# EAGLE design BotMotShielArdu (EAGLE 6.4)
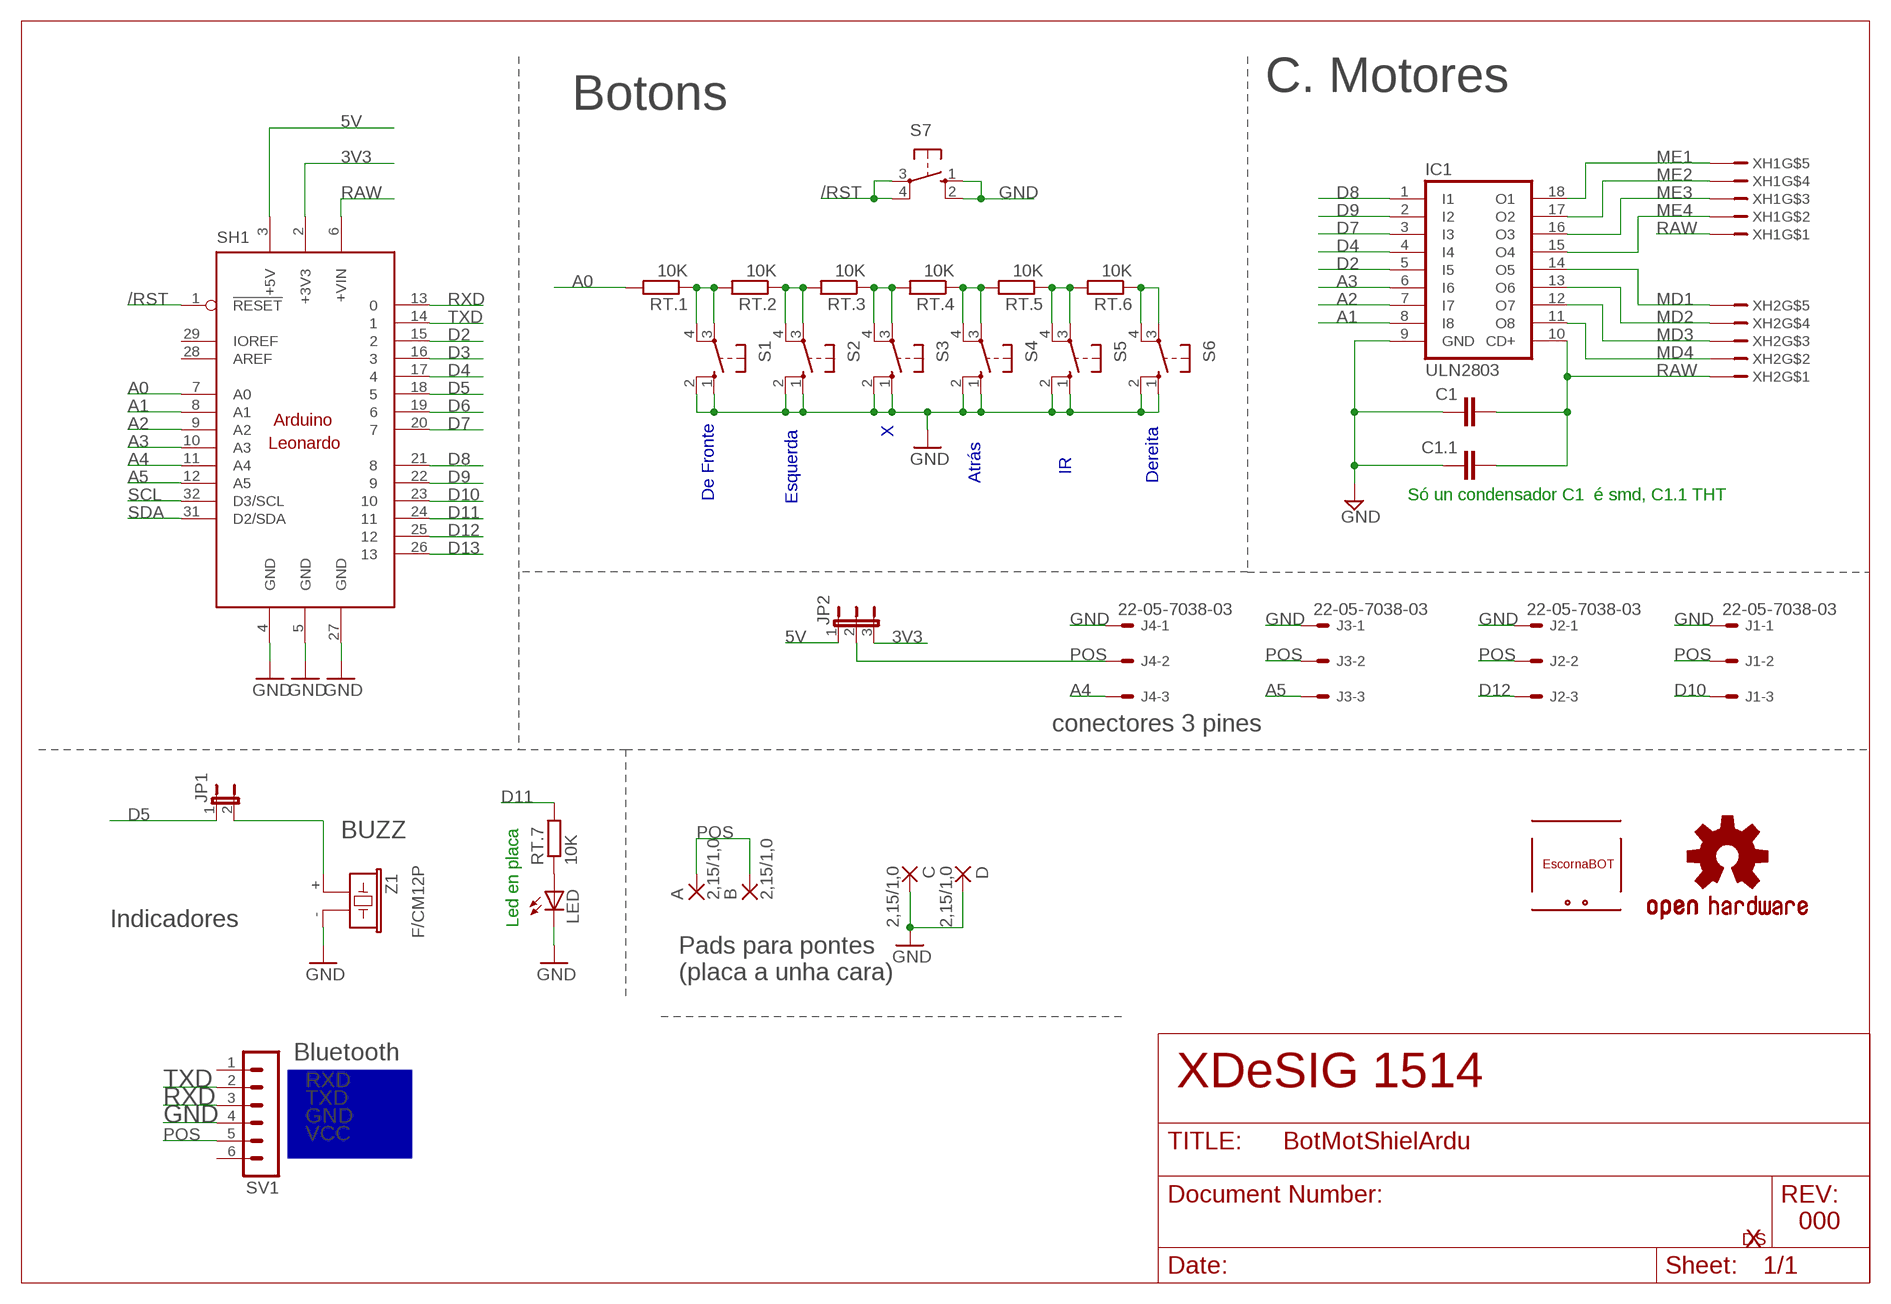
[diagram p0: schematic, sheet 1]

## Parts
A  2,15/1,0  WIREPAD2,15/1,0  [2,15/1,0]
B  2,15/1,0  WIREPAD2,15/1,0  [2,15/1,0]
C  2,15/1,0  WIREPAD2,15/1,0  [2,15/1,0]
C1  C-EUC1206  [C1206]
C1.1  C-EU025-024X044  [C025-024X044]
D  2,15/1,0  WIREPAD2,15/1,0  [2,15/1,0]
IC1  ULN2803  ULN2803A  [DIL18]
J1  22-05-7038-03  [7395-03]
J2  22-05-7038-03  [7395-03]
J3  22-05-7038-03  [7395-03]
J4  22-05-7038-03  [7395-03]
JP1  JP1E  [JP1]
JP2  JP2E  [JP2]
LED  LED5MM  [LED5MM]
LOGO4  OSHW-LOGOS  [OSHW-LOGO-S]
RT.1  10K  R-EU_0204/7  [0204/7]
RT.2  10K  R-EU_0204/7  [0204/7]
RT.3  10K  R-EU_0204/7  [0204/7]
RT.4  10K  R-EU_0204/7  [0204/7]
RT.5  10K  R-EU_0204/7  [0204/7]
RT.6  10K  R-EU_0204/7  [0204/7]
RT.7  10K  R-EU_0204/7  [0204/7]
S1  B3F-40XX  40-XX  [B3F40XX_NH]
S2  B3F-40XX  40-XX  [B3F40XX_NH]
S3  B3F-40XX  40-XX  [B3F40XX_NH]
S4  B3F-40XX  40-XX  [B3F40XX_NH]
S5  B3F-40XX  40-XX  [B3F40XX_NH]
S6  B3F-40XX  40-XX  [B3F40XX_NH]
S7  10-XX  [B3F-10XX]
SH1  ARDUINO_LEONARDO  [LEONARDO]
SV1  MA06-1  [MA06-1]
U$1  ESCORNABOT  [ESCORNA_PEQUE]
U$3  XDESIG1  [XDESIG_CU]
XH1  B5B-XH-A  [B5B-XH-A]
XH2  B5B-XH-A  [B5B-XH-A]
Z1  F/CM12P  [F/CM12P]

## Nets
3V3: JP2.3 SH1.2(+3V3)
5V: JP2.1 SH1.3(+5V)
/RST: S7.3(P) S7.4(P1) SH1.1(!RESET)
A0: RT.1.2 SH1.7(A0)
A1: IC1.8(I8) SH1.8(A1)
A2: IC1.7(I7) SH1.9(A2)
A3: IC1.6(I6) SH1.10(A3)
A4: J4.3 SH1.11(A4)
A5: J3.3 SH1.12(A5)
D2: IC1.5(I5) SH1.15
D3: SH1.16
D4: IC1.4(I4) SH1.17
D5: JP1.1 SH1.18
D6: SH1.19
D7: IC1.3(I3) SH1.20
D8: IC1.1(I1) SH1.21
D9: IC1.2(I2) SH1.22
D10: J1.3 SH1.23
D11: RT.7.2 SH1.24
D12: J2.3 SH1.25
D13: SH1.26
GND: C1.1 C1.1.1 C.1(P) D.1(P) IC1.9(GND) J1.1 J2.1 J3.1 J4.1 LED.K(C) S1.1(S) S1.2(S1) S2.1(S) S2.2(S1) S3.1(S) S3.2(S1) S4.1(S) S4.2(S1) S5.1(S) S5.2(S1) S6.1(S) S6.2(S1) S7.1(S) S7.2(S1) SH1.4(GND) SH1.5(GND) SH1.27(GND) SV1.4 Z1.-
MD1: IC1.14(O5) XH2.P$5
MD2: IC1.13(O6) XH2.P$4
MD3: IC1.12(O7) XH2.P$3
MD4: IC1.11(O8) XH2.P$2
ME1: IC1.18(O1) XH1.P$5
ME2: IC1.17(O2) XH1.P$4
ME3: IC1.16(O3) XH1.P$3
ME4: IC1.15(O4) XH1.P$2
N$9: LED.A RT.7.1
N$28: RT.6.1 S6.3(P) S6.4(P1)
N$29: RT.1.1 RT.2.2 S1.3(P) S1.4(P1)
N$30: JP1.2 Z1.+
N$31: RT.5.1 RT.6.2 S5.3(P) S5.4(P1)
N$32: RT.4.1 RT.5.2 S4.3(P) S4.4(P1)
N$33: RT.3.1 RT.4.2 S3.3(P) S3.4(P1)
N$34: RT.2.1 RT.3.2 S2.3(P) S2.4(P1)
POS: A.1(P) B.1(P) J1.2 J2.2 J3.2 J4.2 JP2.2 SV1.5
RAW: C1.1.2 C1.2 IC1.10(CD+) SH1.6(+VIN) XH1.P$1 XH2.P$1
RXD: SH1.13 SV1.3
SCL: SH1.32(D3/SCL)
SDA: SH1.31(D2/SDA)
TXD: SH1.14 SV1.2
Unconnected: SH1.28(AREF) SH1.29(IOREF) SV1.1 SV1.6

## Notes on the sheet
- C. Motores
- Botons
- Esquerda
- X
- IR
- Atrás | Dereita
- De Fronte | Só un condensador C1  é smd, C1.1 THT
- conectores 3 pines
- BUZZ
- Indicadores | Led en placa
- Pads para pontes
  (placa a unha cara)
- Bluetooth
- RXD | XDeSIG | 1514
- TXD
- GND
- VCC
- 000

## Library data of the parts
A B C D = wirepad:WIREPAD: Wire PAD connect wire on PCB
C1 C1.1 = rcl:C-EU: CAPACITOR, European symbol
IC1 = uln-udn:ULN2803A: DRIVER ARRAY
J1-J4 = con-molex:22-?-03: CONNECTOR wire to board 2.54 mm (.1 inch) pitch header; OC_FARNELL: unknown; OC_NEWARK: unknown
JP1 = jumper:JP1E: JUMPER
JP2 = jumper:JP2E: JUMPER
LED = adafruit:LED: LED OSRAM: - CHIPLED LG R971, LG N971, LY N971, LG Q971, LY Q971, LO R971, LY R971 LH N974, LH R974 LS Q976, LO Q976, LY Q976 LO Q996 - Hyper CHIPLED LW Q18S LB Q993, LB Q99A, LB R99A - SideLED LS A670, LO A670, LY A670, LG A670, LP A670 LB A673, LV A673, LT A673, LW A673 LH A674 LY A675 LS A676, LA A676, LO A676, LY A676, LW A676 LS A679, LY A679, LG A679 - Hyper Micro SIDELED® LS Y876, LA Y876, LO Y876, LY Y876 LT Y87S - SmartLED LW L88C, LW L88S LB L89C, LB L89S, LG L890 LS L89K, LO L89K, LY L89K LS L896, LA L896, LO L896, LY L896 - TOPLED LS T670, LO T670, LY T670, LG T670, LP T670 LSG T670, LSP T670, LSY T670, LOP T670, LYG T670 LG T671, LOG T671, LSG T671 LB T673, LV T673, LT T673, LW T673 LH T674 LS T676, LA T676, LO T676, LY T676, LB T676, LH T676, LSB T676, LW T676 LB T67C, LV T67C, LT T67C, LS T67K, LO T67K, LY T67K, LW E67C LS E67B, LA E67B, LO E67B, LY E67B, LB E67C, LV E67C, LT E67C LW T67C LS T679, LY T679, LG T679 LS T770, LO T770, LY T770, LG T770, LP T770 LB T773, LV T773, LT T773, LW T773 LH T774 LS E675, LA E675, LY E675, LS T675 LS T776, LA T776, LO T776, LY T776, LB T776 LHGB T686 LT T68C, LB T68C - Hyper Mini TOPLED® LB M676 - Mini TOPLED Santana® LG M470 LS M47K, LO M47K, LY M47K Source: http://www.osram.convergy.de/
LOGO4 = SparkFun-Aesthetics:OSHW-LOGO: Open Source Hardware Logo This logo indicates the piece of hardware it is found on incorporates a OSHW license and/or adheres to the definition of open source hardware found here: http://freedomdefined.org/OSHW
RT.1-RT.7 = rcl:R-EU_: RESISTOR, European symbol
S1-S6 = switch-omron:40-XX: OMRON SWITCH
S7 = switch-omron:10-XX: OMRON SWITCH; MPN: B3F-1000; OC_FARNELL: 176432; OC_NEWARK: 36M3542
SH1 = arduino:ARDUINO_LEONARDO: SHIELD FOR ARDUINO LEONARDO DRAW BY Xabier Rosas
SV1 = con-lstb:MA06-1: PIN HEADER; OC_FARNELL: unknown; OC_NEWARK: unknown
U$1 = escorna:ESCORNABOT
U$3 = xdesig:XDESIG
XH1 XH2 = con-jst:B5B-XH-A
Z1 = buzzer:F/CM12P: BUZZER Source: Buerklin; OC_FARNELL: unknown; OC_NEWARK: unknown

## Net classes
0 default: clearance 0.355 mm

## Board
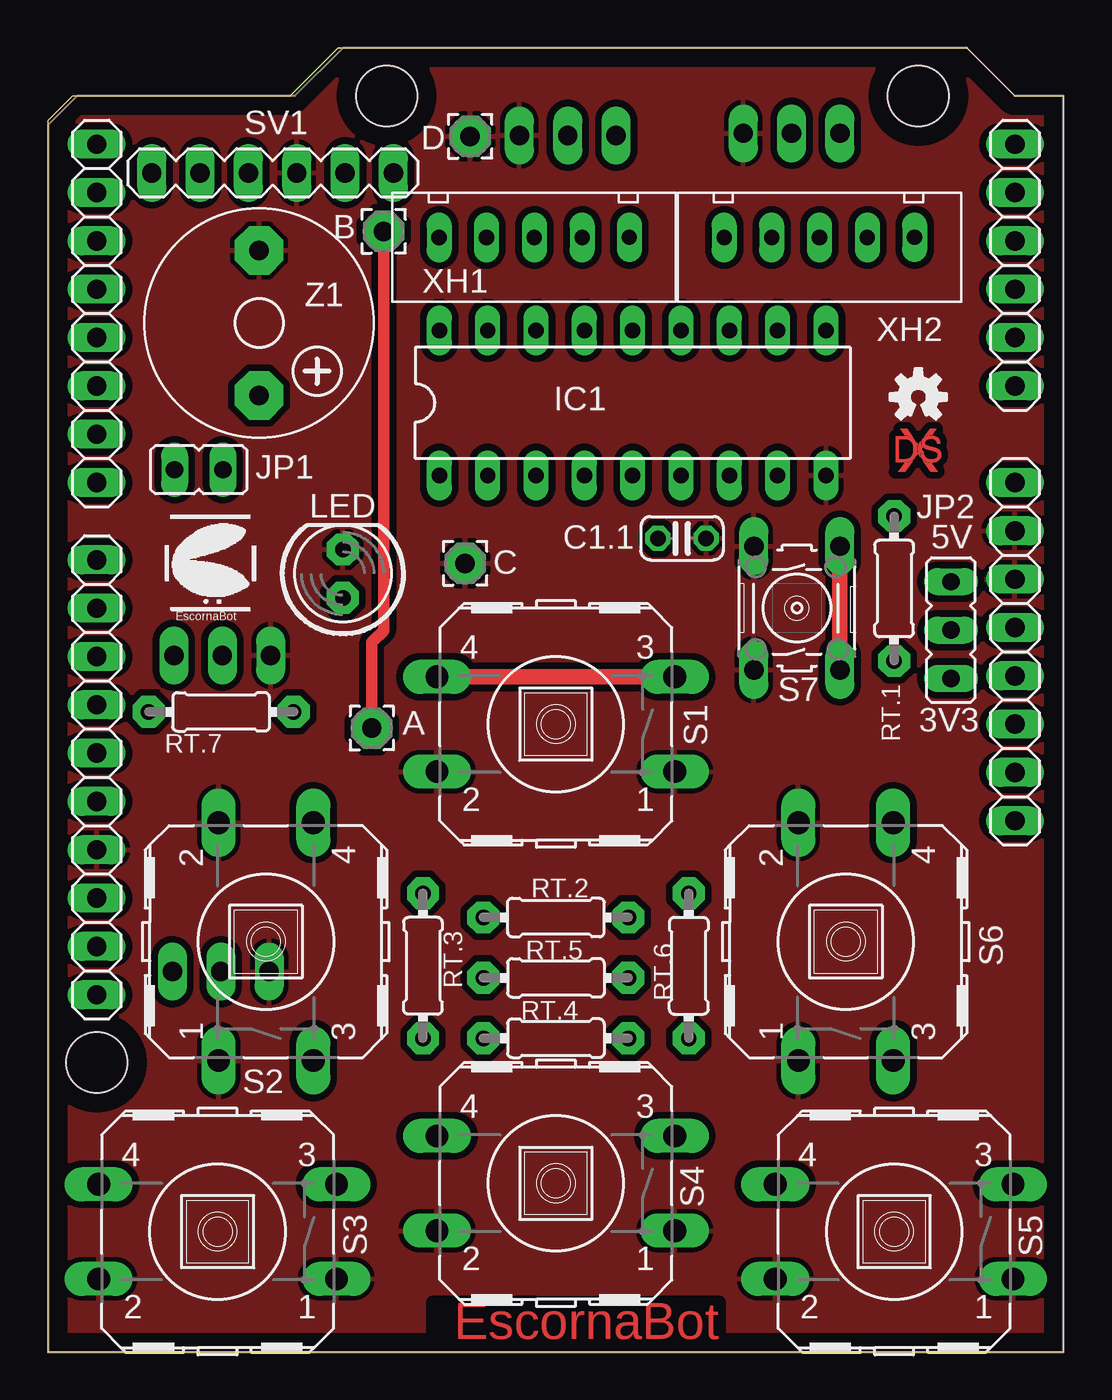
[diagram p1: board, top side]
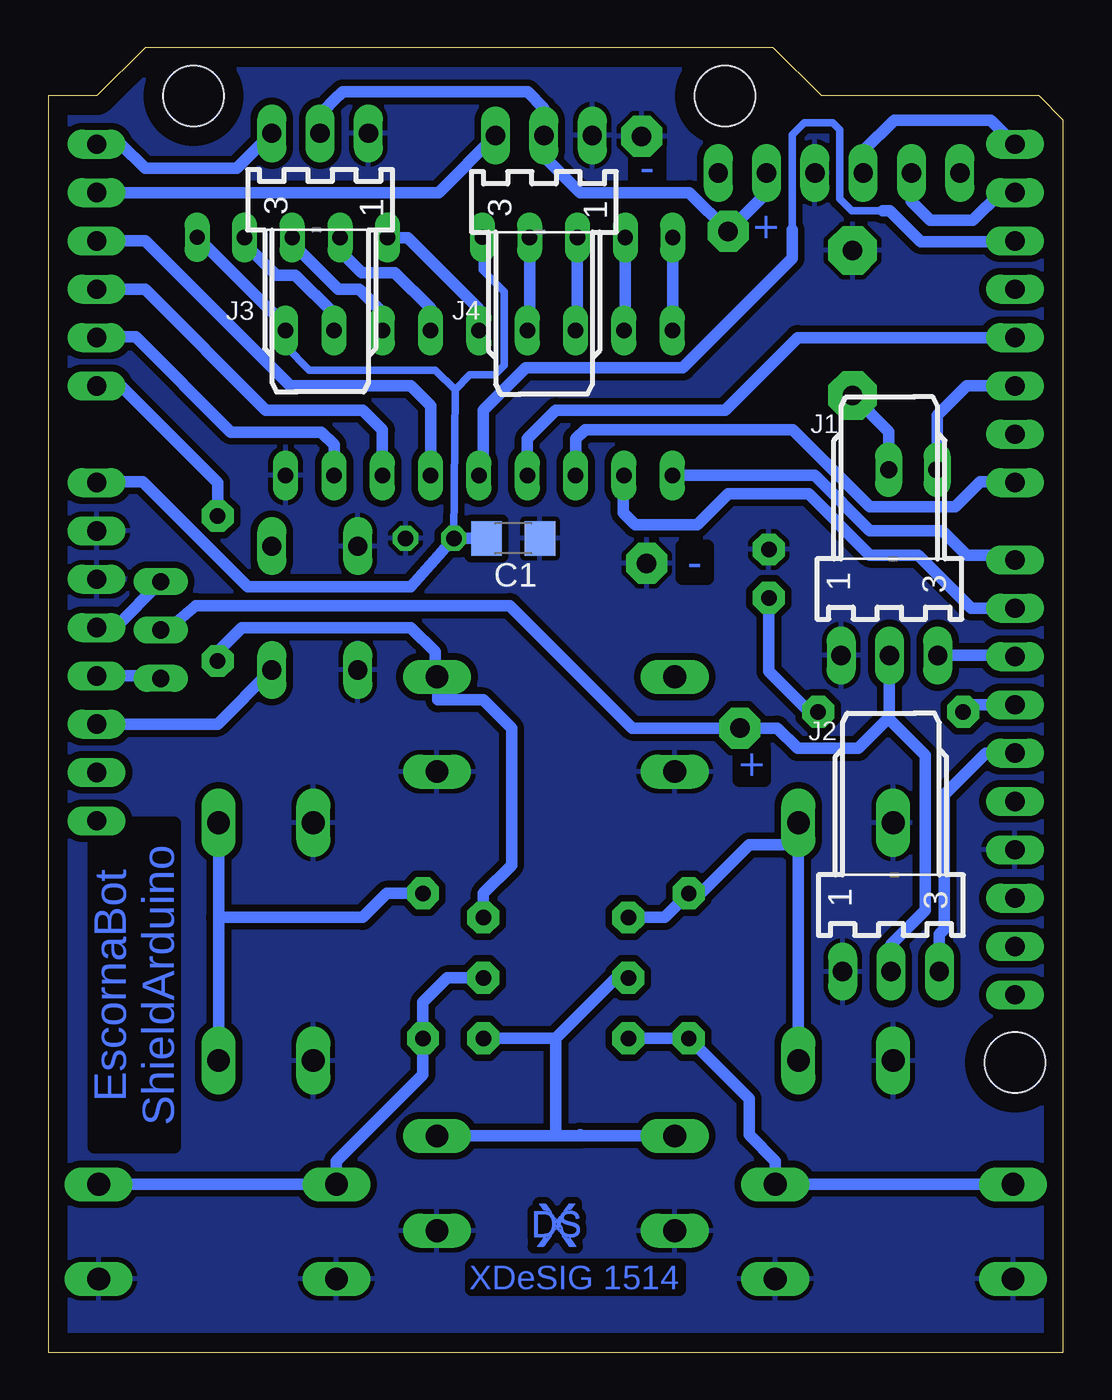
[diagram p2: board, bottom side, seen from below]

Size 53.34 x 68.58 mm. Coordinates in mm from the lower left corner, seen from the top.
Outline: 53.34,66.04 53.34,0 0,0 0,64.77 1.27,66.04 12.7,66.04 15.24,68.58 48.26,68.58 50.8,66.04 53.34,66.04
Copper layers (1*16): Top 0.035mm / dielectric 1.5mm / Bottom 0.035mm
Design rules "default": minimum track width 10mil, minimum drill 24mil, track to track 8mil, track to pad 8mil, pad to pad 8mil, via to via 8mil, smd to smd 8mil, copper to edge 40mil, drill to drill 8mil, minimum pad ring 10mil, minimum via ring 8mil, stop-mask expansion 4mil, vias tented up to drill 0mil, thermal gap 10mil

### Footprints (pad centres in the part's own frame; a part is rotated, then mirrored left to right if it is on the bottom)
2,15/1,0 = drill 1.016 pad 2.159 octagon: 1 0,0
C1206 = smd 1.6 x 1.8: 1 -1.4,0; 2 1.4,0
C025-024X044 = drill 0.813 octagon: 1 -1.27,0; 2 1.27,0
DIL18 = drill 0.813 long: 1 -10.16,-3.81; 2 -7.62,-3.81; 3 -5.08,-3.81; 4 -2.54,-3.81; 5 0,-3.81; 6 2.54,-3.81; 7 5.08,-3.81; 8 7.62,-3.81; 9 10.16,-3.81; 10 10.16,3.81; 11 7.62,3.81; 12 5.08,3.81; 13 2.54,3.81; 14 0,3.81; 15 -2.54,3.81; 16 -5.08,3.81; 17 -7.62,3.81; 18 -10.16,3.81
7395-03 = drill 1.016 long: 1 2.54,0; 2 0,0; 3 -2.54,0
JP1 = drill 0.914 long: 1 0,-1.27; 2 0,1.27
JP2 = drill 0.914 long: 1 -2.54,0; 2 0,0; 3 2.54,0
LED5MM = drill 0.813 pad 1.676 octagon: A -1.27,0; K 1.27,0
0204/7 = drill 0.813 pad 1.676 octagon: 1 -3.81,0; 2 3.81,0
B3F40XX_NH = drill 1.194 long: 1 -6.248,2.489; 2 6.248,2.489; 3 -6.248,-2.489; 4 6.248,-2.489
B3F-10XX = drill 1.016 long: 1 -3.251,2.261; 2 3.251,2.261; 3 -3.251,-2.261; 4 3.251,-2.261
LEONARDO = drill 1.016 long: 1 -24.13,1.27; 2 -24.13,-1.27; 3 -24.13,-3.81; 4 -24.13,-6.35; 5 -24.13,-8.89; 6 -24.13,-11.43; 7 -24.13,-16.51; 8 -24.13,-19.05; 9 -24.13,-21.59; 10 -24.13,-24.13; 11 -24.13,-26.67; 12 -24.13,-29.21; 13 24.13,-29.21; 14 24.13,-26.67; 15 24.13,-24.13; 16 24.13,-21.59; 17 24.13,-19.05; 18 24.13,-16.51; 19 24.13,-13.97; 20 24.13,-11.43; 21 24.13,-7.366; 22 24.13,-4.826; 23 24.13,-2.286; 24 24.13,0.254; 25 24.13,2.794; 26 24.13,5.334; 27 24.13,7.874; 28 24.13,10.414; 29 -24.13,3.81; 30 -24.13,6.35; 31 24.13,12.954; 32 24.13,15.494 | hole 3.2: 24.13,19.05; 8.89,-31.75; -19.05,-31.75
MA06-1 = drill 1.016 long: 1 -6.35,0; 2 -3.81,0; 3 -1.27,0; 4 1.27,0; 5 3.81,0; 6 6.35,0
B5B-XH-A = drill 0.8 long: P$1 -5.17,-0.19; P$2 -2.69,-0.175; P$3 -0.175,-0.175; P$4 2.34,-0.175; P$5 4.83,-0.175
F/CM12P = drill 1.016 pad 2.54 octagon: + 3.81,0; - -3.81,0

### Placement (x,y rotation side)
A  17,32.81 0 top
B  17.61,58.92 0 top
C  21.9,41.47 0 top
C1  28.91,42.78 180 bottom
C1.1  33.3,42.79 180 top
D  22.16,63.91 0 top
IC1  30.71,49.91 0 top
J1  9.14,36.63 180 bottom
J2  9.06,20.02 180 bottom
J3  39.06,64.08 0 bottom
J4  27.3,63.96 0 bottom
JP1  7.91,46.39 270 top
JP2  47.44,37.97 270 top
LED  15.47,40.93 90 top
LOGO4  45.72,50.22 0 top
RT.1  44.45,40.15 90 top
RT.2  26.67,22.86 0 top
RT.3  19.68,20.32 90 top
RT.4  26.67,16.51 180 top
RT.5  26.67,19.68 180 top
RT.6  33.66,20.32 270 top
RT.7  9.07,33.66 180 top
S1  26.67,33.02 180 top
S2  11.43,21.59 90 top
S3  8.89,6.35 180 top
S4  26.67,8.89 180 top
S5  44.45,6.35 180 top
S6  41.91,21.59 90 top
S7  39.34,39.12 90 top
SH1  26.67,34.29 180 top
SV1  11.79,61.99 0 top
U$1  6.04,38.9 0 top
U$2  XDESIG1  [XDESIG_CU]  44.52,46.3 0 top
U$3  27.8,5.57 0 bottom
XH1  25.36,58.42 180 top
XH2  40.35,58.42 180 top
Z1  11.07,54.11 270 top

### Tracks (layer width: path | path; a pad name or v marks a point on that pad's centre or on a via)
3V3
  Bottom 0.61: SH1.2 47.57,35.56 JP2.3
5V
  Bottom 0.61: SH1.3 49.84,38.1 JP2.1
/RST
  Top 0.813: S7.4 S7.3
  Bottom 0.61: SH1.1 44.45,33.02 S7.3
A0
  Bottom 0.61: SH1.7 49.53,50.8 44.45,45.72 RT.1.2
A1
  Bottom 0.61: IC1.8 38.33,47.7 39,48.38 43.75,48.38 48.75,53.38 50.77,53.38 SH1.8
A2
  Bottom 0.61: IC1.7 35.79,48.49 36.83,49.53 41.91,49.53 48.26,55.88 SH1.9
A3
  Bottom 0.61: SH1.10 48.26,58.42 40.64,50.8 34.29,50.8 33.25,49.76 IC1.6
A4
  Bottom 0.61: SH1.11 32.84,60.96 J4.3
A5
  Bottom 0.61: SH1.12 49.53,63.5 48.26,62.23 43.45,62.23 J3.3
D2
  Bottom 0.406: 14.25,59 14.25,64 13.62,64.62 12.12,64.62 11.75,64.25 11.75,60.62 11.12,60 9.5,60
  Bottom 0.61: IC1.5 30.71,45.95 30.48,45.72 30.48,49.52 28.25,51.75 20,51.75 14.25,57.5 14.25,59 | 9.5,60 9.12,60 7.5,58.38 2.58,58.38 SH1.15
D4
  Bottom 0.61: IC1.4 28.17,48.03 26.67,49.53 17.78,49.53 13.97,53.34 SH1.17
D5
  Bottom 0.61: SH1.18 5.08,50.8 6.63,49.24 JP1.1
D7
  Bottom 0.61: IC1.3 25.63,48.03 25.4,48.26 25.36,48.26 25.12,48.5 14.21,48.5 10.16,44.45 5.67,44.45 4.38,45.75 2.57,45.75 SH1.20
D8
  Bottom 0.61: IC1.1 13.07,46.09 10.16,43.18 6.35,43.18 5.08,41.91 2.79,41.91 SH1.21 2.76,41.88
D9
  Bottom 0.61: IC1.2 23.12,46.06 23.12,44.12 22.5,43.5 19.23,43.5 17.61,45.12 13.38,45.12 10.16,41.91 7.62,41.91 4.83,39.12 SH1.22
D10
  Bottom 0.61: J1.3 2.59,36.63 SH1.23
D11
  Bottom 0.61: SH1.24 4.89,34.04 RT.7.2
D12
  Bottom 0.61: SH1.25 4.06,31.5 6.25,29.31 6.25,22.25 6.52,21.98 J2.3
GND
  pour Bottom: 0,0 0,69.85 53.34,69.85 53.34,0
  pour Bottom: 0,0 0,64.77 1.27,66.04 12.7,66.04 15.24,68.58 48.26,68.58 50.8,66.04 53.34,66.04 53.34,0
  pour Top: 0,0 0,64.77 1.27,66.04 12.7,66.04 15.24,68.58 48.26,68.58 50.8,66.04 53.34,66.04 53.34,0
MD1
  Bottom 0.61: IC1.14 30.71,54.84 34.47,58.59 XH2.P$5
MD2
  Bottom 0.61: 38.01,58.33 XH2.P$4 38.01,57.88 37.88,57.75 37.81,57.69 36.88,56.75 35.12,56.75 33.25,54.88 IC1.13
MD3
  Bottom 0.61: XH2.P$3 40.52,58.3 38.09,55.88 37,55.88 35.79,54.66 IC1.12
MD4
  Bottom 0.61: IC1.11 38.33,54.58 40.38,56.62 41.38,56.62 43.04,58.29 XH2.P$2
ME1
  Bottom 0.61: XH1.P$5 20.53,53.73 IC1.18
ME2
  Bottom 0.61: XH1.P$4 23.02,53.78 IC1.17
ME3
  Bottom 0.61: XH1.P$3 25.54,53.81 IC1.16
ME4
  Bottom 0.61: XH1.P$2 28.05,53.84 IC1.15
N$9
  Bottom 0.61: RT.7.1 13.35,33.66 15.47,35.8 LED.A
N$28
  Bottom 0.61: S6.4 44.4,22.86 | 44.4,22.86 S6.3 | RT.6.1 35.56,24.13 36.83,22.86 44.4,22.86
N$29
  Top 0.813: S1.4 S1.3
  Bottom 0.61: RT.2.2 30.48,24.13 28.99,25.62 28.99,32.8 30.48,34.29 32.87,34.29 S1.3 33.02,35.61 33.02,36.83 34.29,38.1 43.18,38.1 44.45,36.83 RT.1.1
N$30
  Bottom 0.61: JP1.2 9.18,48.4 Z1.+
N$31
  Bottom 0.61: RT.5.1 32.38,19.68 33.66,18.41 RT.6.2 33.66,14.61 38.2,10.06 S5.4 S5.3
N$32
  Bottom 0.61: S4.4 25.35,11.38 25.4,11.43 25.45,11.38 26.67,11.38 | RT.5.2 23.5,19.68 26.67,16.51 | 26.67,16.51 26.67,11.38 | RT.4.1 26.67,16.51 | S4.3 26.67,11.38
N$33
  Bottom 0.61: S3.4 S3.3 15.14,10.06 16.51,11.43 16.51,13.34 RT.3.1 RT.4.2
N$34
  Bottom 0.61: RT.2.1 20.95,22.86 RT.3.2 19.05,24.13 16.51,26.67 14.02,26.67 S2.4 S2.3
POS
  Top 0.61: A.1 17,37.31 17.61,37.94 B.1
  Bottom 0.61: J2.2 9.06,21.42 7.62,22.86 7.62,22.88 7.25,23.25 7.25,31.38 9.14,33.27 9.14,33.38 | J1.2 9.14,33.38 | 9.14,33.38 10.77,31.75 13.97,31.75 15.04,32.81 A.1 22.66,32.81 29.09,39.24 45.59,39.24 47.12,37.97 JP2.2 | J3.2 39.06,65.08 38.1,66.04 38.09,66.04 37.88,66.25 28.15,66.25 27.3,65.39 J4.2 27.3,62.85 25.4,60.96 19.66,60.96 B.1 15.6,60.94 SV1.5
RAW
  Bottom 0.406: XH1.P$1 30.53,56.91 29.38,55.75 29.38,51.88 29.88,51.38 31.19,51.38 31.97,50.59 | C1.1.2 31.97,50.59 | 31.97,50.59 33,51.62 39.62,51.62 40.88,52.88 IC1.10
  Bottom 0.61: XH2.P$1 40.87,53.96 IC1.10 40.87,53.24 | SH1.6 50.09,45.72 50.06,45.75 48.38,45.75 42.88,40.25 34.3,40.25 C1.1.2 30.32,42.79 C1.2
RXD
  Bottom 0.61: SV1.3 10.52,63.15 8.89,64.77 3.81,64.77 SH1.13
TXD
  Bottom 0.61: SH1.14 3.29,60.96 4.75,59.5 7,59.5 8,60.5 8,61.97 SV1.2

### Text on the board
Top: EscornaBot
Bottom: - | + | - | + | EscornaBot / ShieldArduino | XDeSIG 1514
tPlace: 5V | 3V3